# Altium schematic sheet Sht4-Interfaces.SchDoc
size D; SheetNumber: 4; SheetTotal: 4
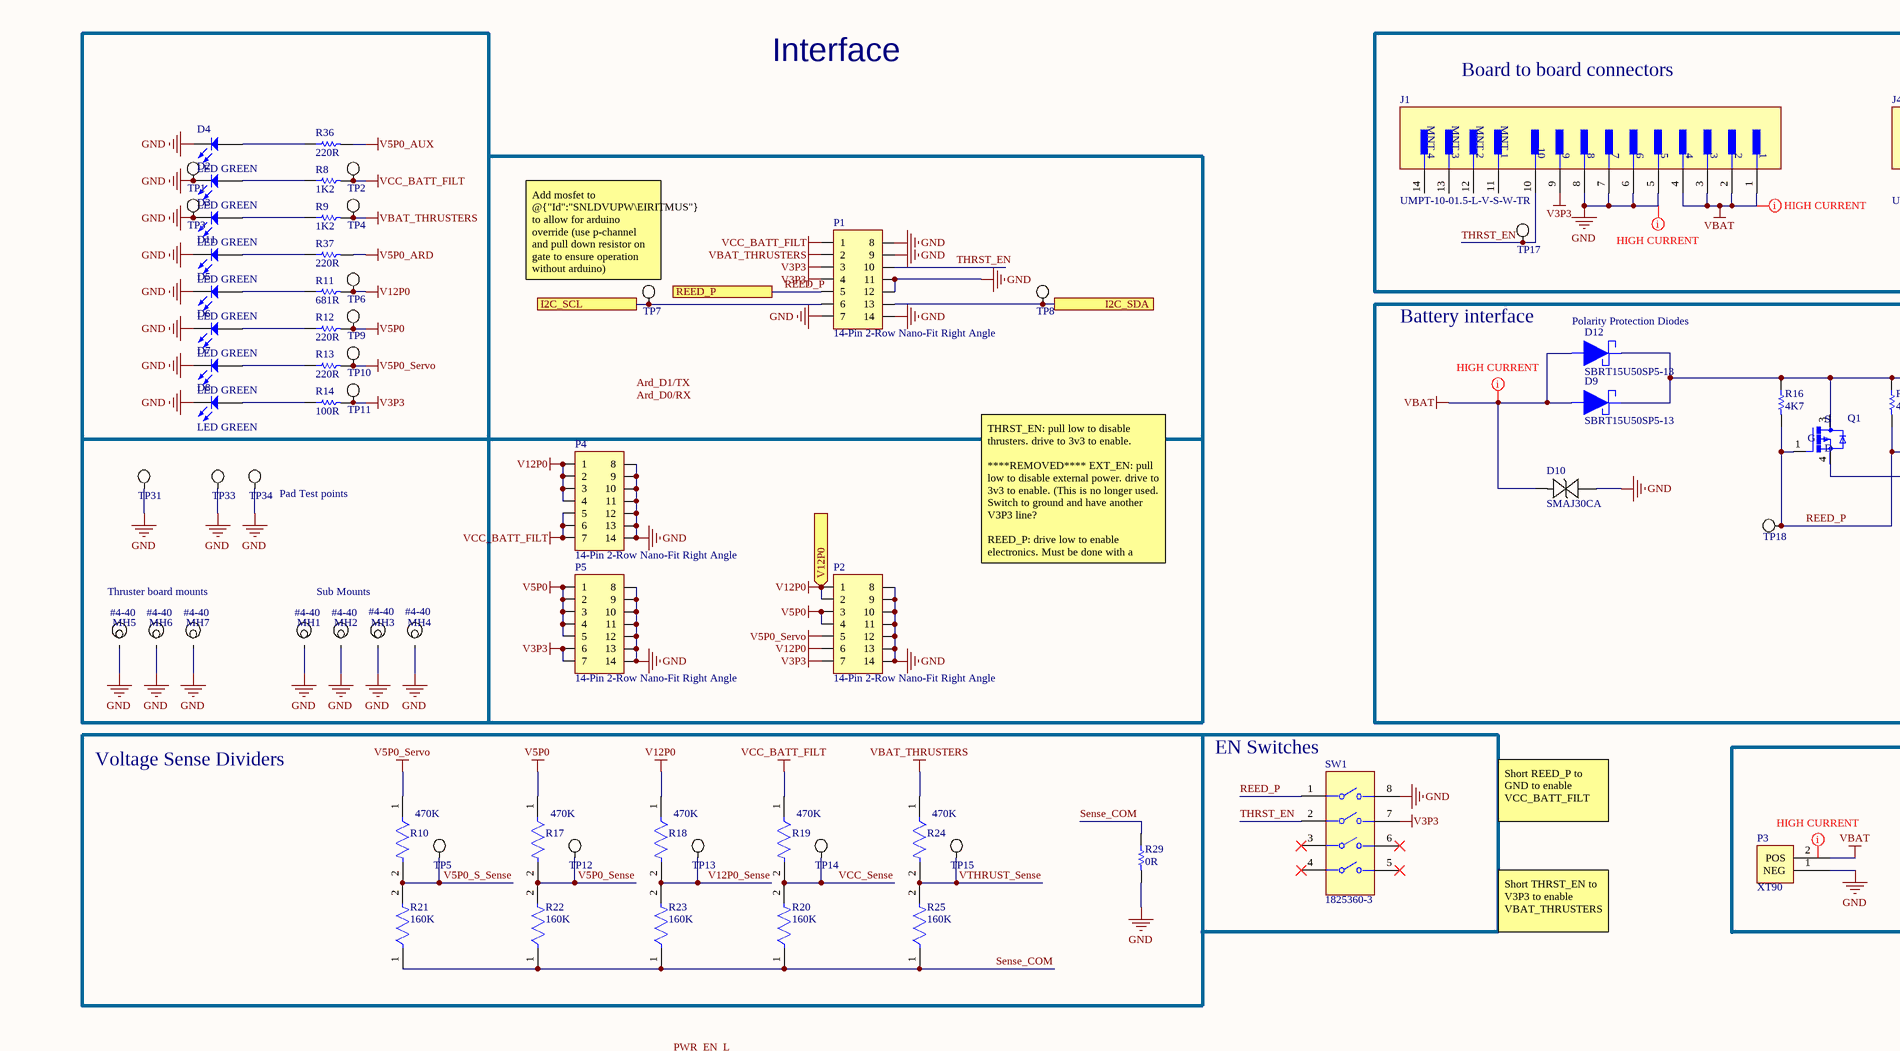
[diagram p0: Sht4-Interfaces.SchDoc, top left]
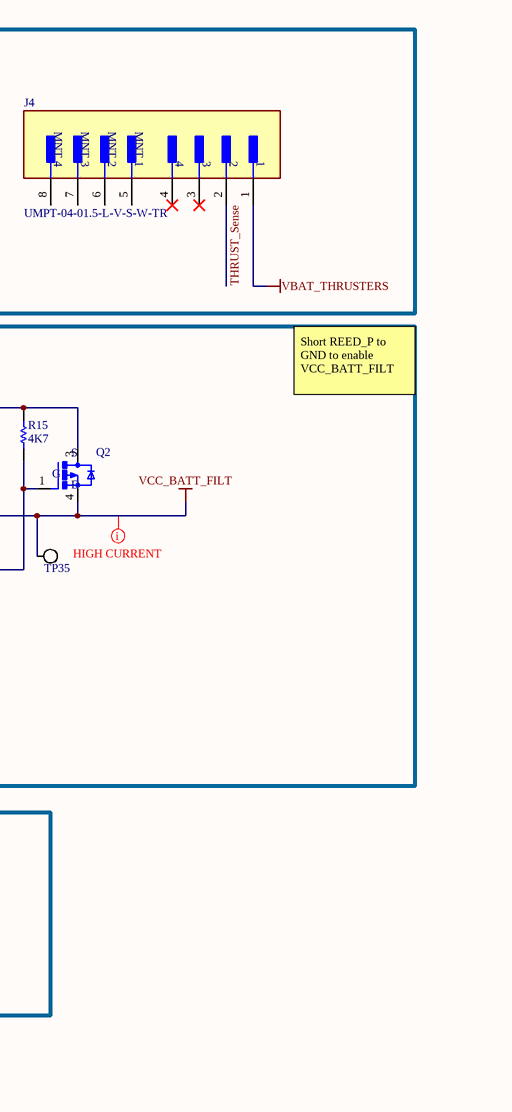
[diagram p1: Sht4-Interfaces.SchDoc, top right]
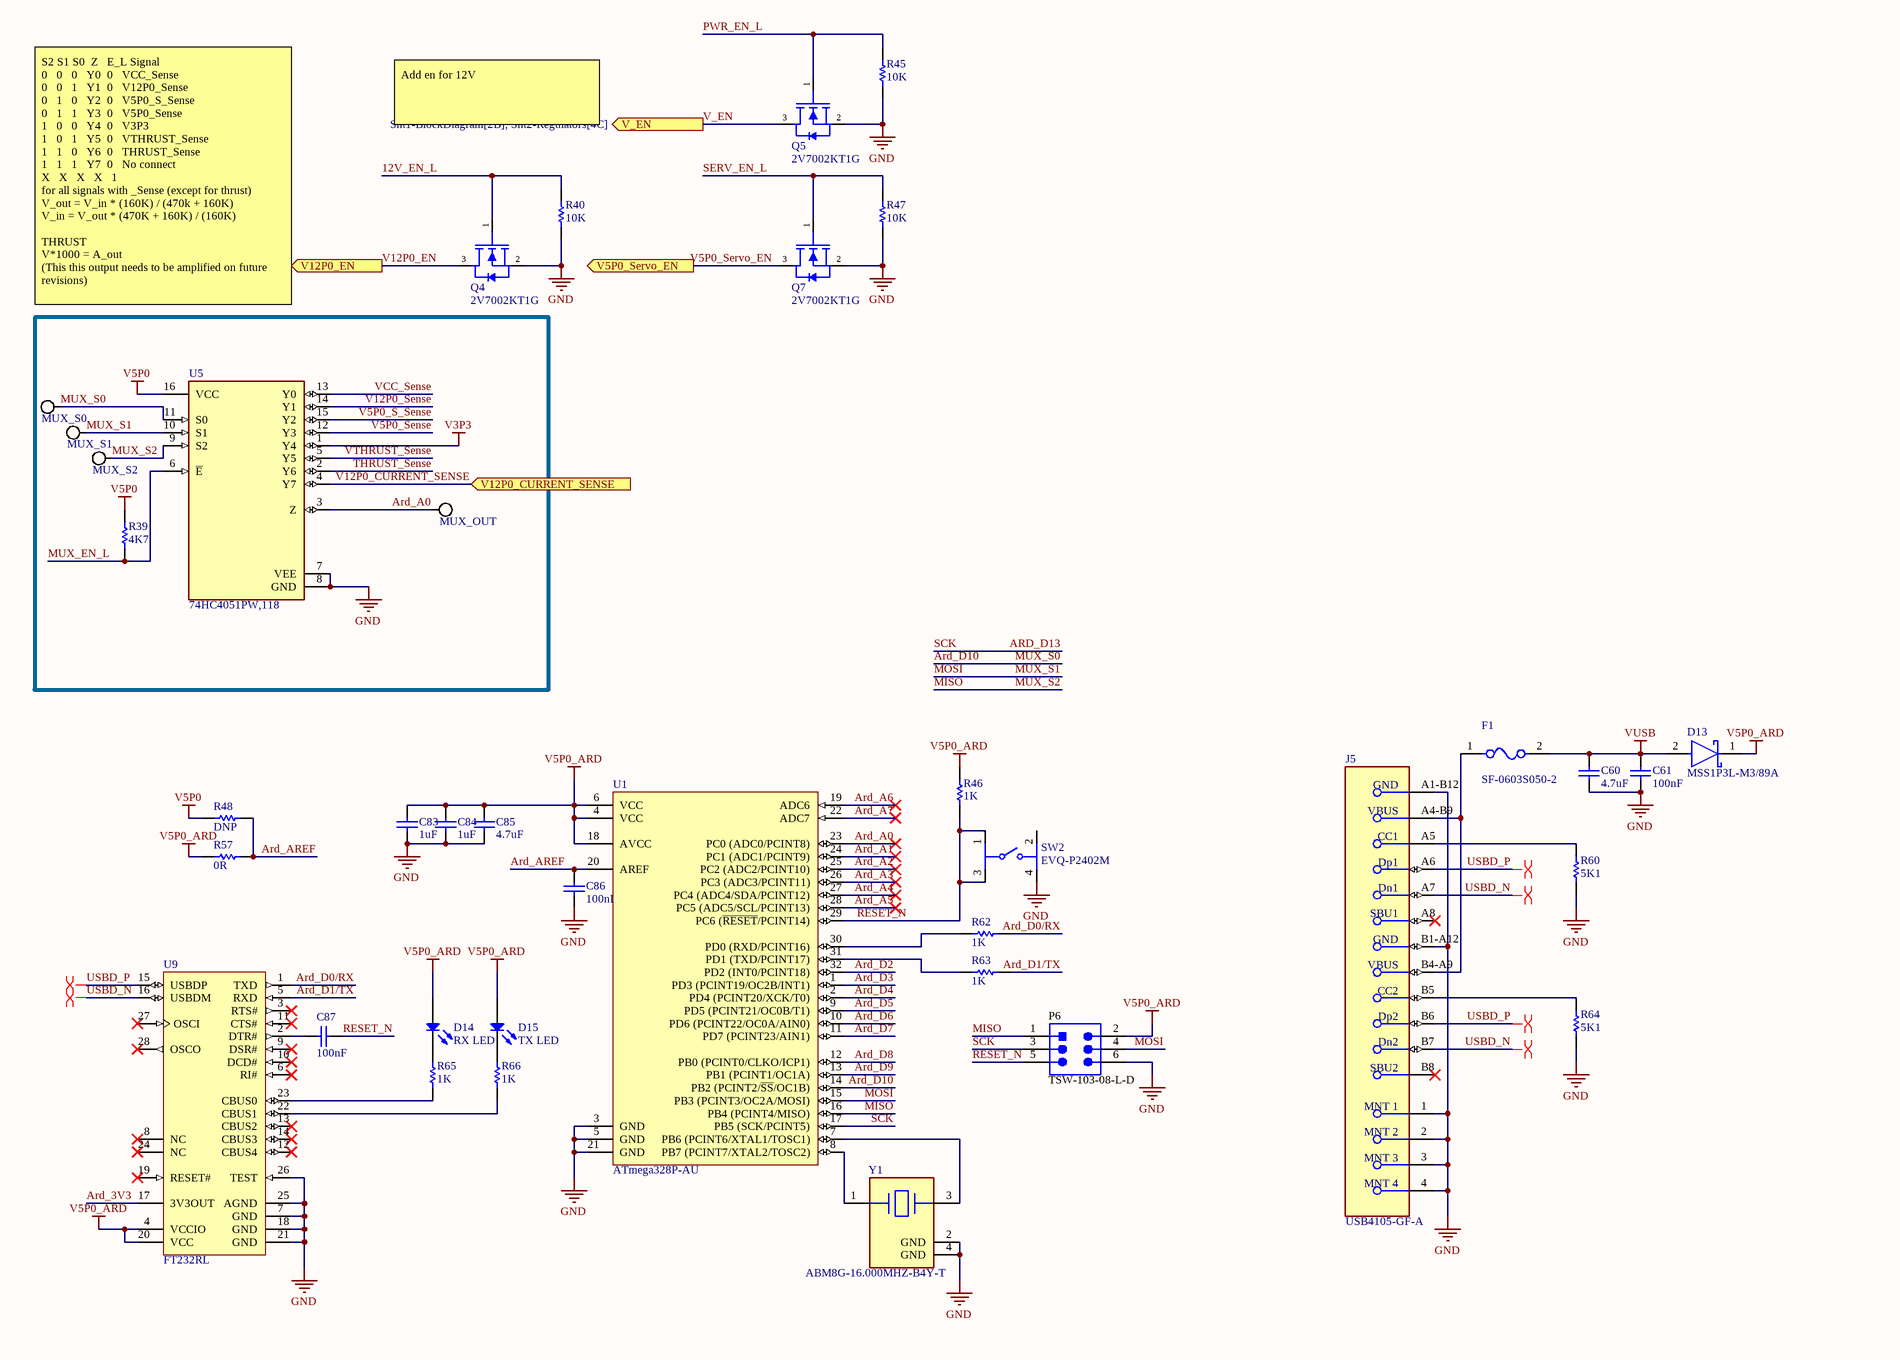
[diagram p2: Sht4-Interfaces.SchDoc, bottom left]
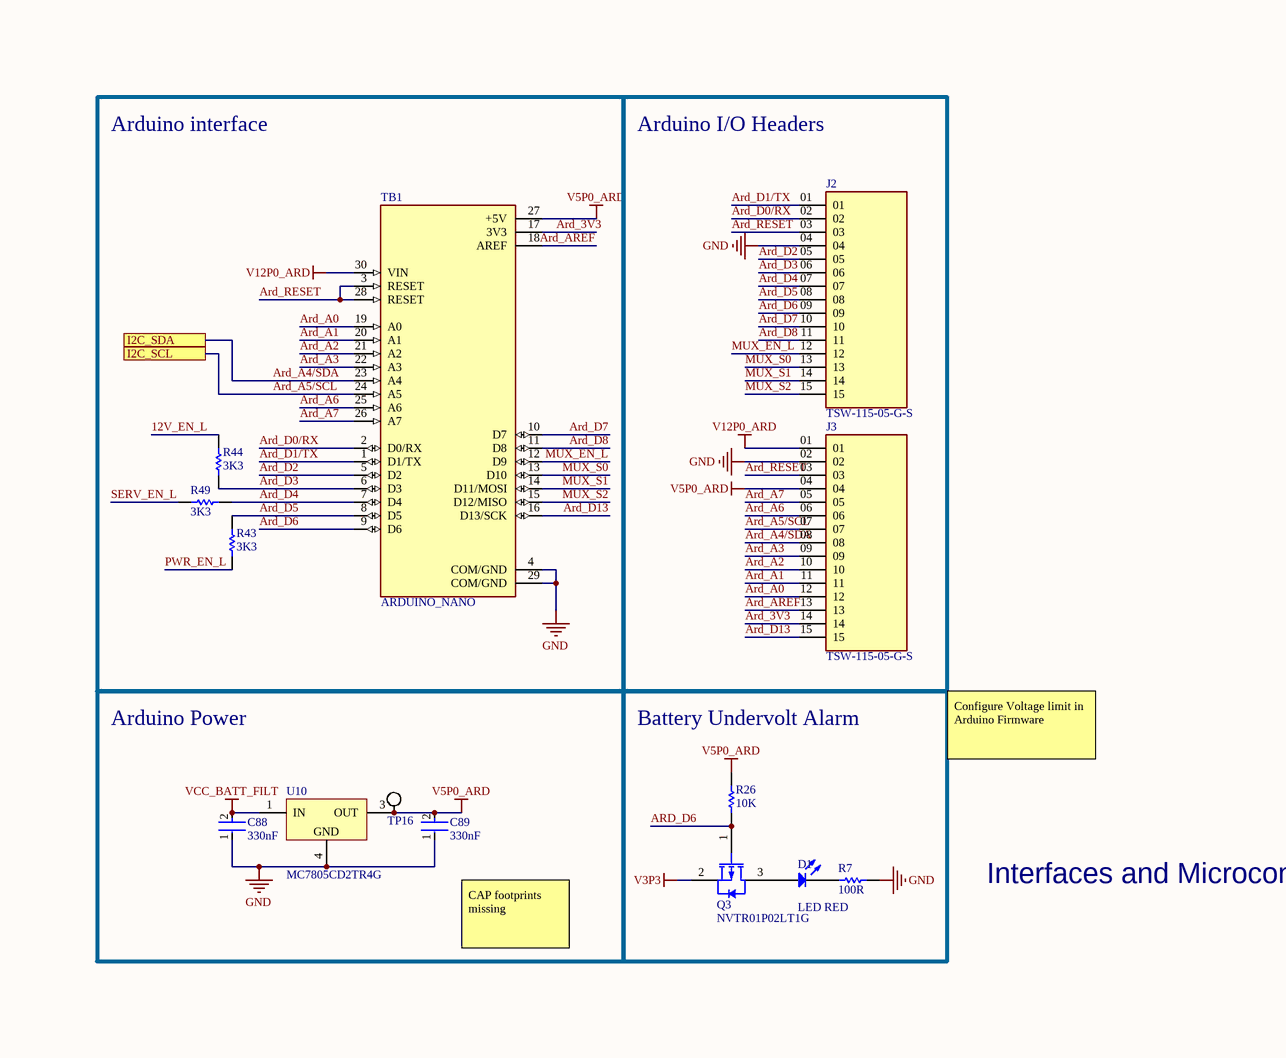
[diagram p3: Sht4-Interfaces.SchDoc, bottom right]

## Parts
C60  4.7uF  [CAPC2013X145X50LL20T25]
C61  100nF  [0603]
C83  1uF  [0603]
C84  1uF  [0603]
C85  4.7uF  [CAPC2013X145X50LL20T25]
C86  100nF  [0603]
C87  100nF  [0603]
C88  330nF  [FP-C1608-080-0_1-IPC_B]
C89  330nF  [FP-C1608-080-0_1-IPC_B]
D1  LED RED  [C0805]
D2  LED GREEN  [LED_0805]
D3  LED GREEN  [LED_0805]
D4  LED GREEN  [LED_0805]
D5  LED GREEN  [LED_0805]
D6  LED GREEN  [LED_0805]
D7  LED GREEN  [LED_0805]
D8  LED GREEN  [LED_0805]
D9  SBRT15U50SP5-13  [SBRT15U50SP5-13]
D10  SMAJ30CA  [SMASeries_LTF]
D11  LED GREEN  [LED_0805]
D12  SBRT15U50SP5-13  [SBRT15U50SP5-13]
D13  MSS1P3L-M3/89A  [FP-96591-MFG]
D14  RX LED  [LED_0805]
D15  TX LED  [LED_0805]
F1  SF-0603S050-2  [FP-SF-0603S-MFG]
J1  UMPT-10-01.5-L-V-S-W-TR  [FP-UMPT-10-01_5-L-V-S-W-T-MFG]
J2  TSW-115-05-G-S  [SAMTEC_TSW-115-05-G-S]
J3  TSW-115-05-G-S  [SAMTEC_TSW-115-05-G-S]
J4  UMPT-04-01.5-L-V-S-W-TR  [FP-UMPT-04-01_5-L-V-S-W-T-MFG]
J5  USB4105-GF-A  [FP-USB4105-GF-A-MFG]
MH1  #4-40  [Mounting Hole #4-40]
MH2  #4-40  [Mounting Hole #4-40]
MH3  #4-40  [Mounting Hole #4-40]
MH4  #4-40  [Mounting Hole #4-40]
MH5  #4-40  [Mounting Hole #4-40]
MH6  #4-40  [Mounting Hole #4-40]
MH7  #4-40  [Mounting Hole #4-40]
MUX_OUT  (no value)  [Test Point Pad]
MUX_S0  (no value)  [Test Point Pad]
MUX_S1  (no value)  [Test Point Pad]
MUX_S2  (no value)  [Test Point Pad]
P1  14-Pin 2-Row Nano-Fit Right Angle  [MOLEX NANO-FIT 2X7 - Right Angle]
P2  14-Pin 2-Row Nano-Fit Right Angle  [MOLEX NANO-FIT 2X7 - Right Angle]
P3  XT90  [XT90]
P4  14-Pin 2-Row Nano-Fit Right Angle  [MOLEX NANO-FIT 2X7 - Right Angle]
P5  14-Pin 2-Row Nano-Fit Right Angle  [MOLEX NANO-FIT 2X7 - Right Angle]
P6  TSW-103-08-L-D  [SMTC-TSW-103-08-L-D_V]
Q1  IRF9Z34STRLPBF  [TO254P1521X483-4N]  (value not drawn)
Q2  IRF9Z34STRLPBF  [TO254P1521X483-4N]  (value not drawn)
Q3  NVTR01P02LT1G  [ONSC-SOT-23-3-318-08_V]
Q4  2V7002KT1G  [2V7002KT1G]
Q5  2V7002KT1G  [2V7002KT1G]
Q7  2V7002KT1G  [2V7002KT1G]
R7  100R  [RESC1609X50X30NL10T20]
R8  1K2  [RESC0603(1608)_L]
R9  1K2  [RESC0603(1608)_L]
R10  470K  [FP-CRCW0805-e3-IPC_C]
R11  681R  [RESC0603(1608)_L]
R12  220R  [RESC0603(1608)_L]
R13  220R  [RESC0603(1608)_L]
R14  100R  [RESC0603(1608)_L]
R15  4K7  [0603]
R16  4K7  [0603]
R17  470K  [FP-CRCW0805-e3-IPC_C]
R18  470K  [FP-CRCW0805-e3-IPC_C]
R19  470K  [FP-CRCW0805-e3-IPC_C]
R20  160K  [FP-CRCW0805-e3-IPC_C]
R21  160K  [FP-CRCW0805-e3-IPC_C]
R22  160K  [FP-CRCW0805-e3-IPC_C]
R23  160K  [FP-CRCW0805-e3-IPC_C]
R24  470K  [FP-CRCW0805-e3-IPC_C]
R25  160K  [FP-CRCW0805-e3-IPC_C]
R26  10K  [RESC1609X50X30NL8T20]
R29  0R  [RESC2013X50X30LL20T20]
R36  220R  [RESC0603(1608)_L]
R37  220R  [RESC0603(1608)_L]
R39  4K7  [0603]
R40  10K  [0603]
R43  3K3  [RESC1609X55X30ML15T15]
R44  3K3  [RESC1609X55X30ML15T15]
R45  10K  [0603]
R46  1K  [RESC1608X55X30LL15T15]
R47  10K  [0603]
R48  DNP  [0805]  (no BOM)
R49  3K3  [RESC1609X55X30ML15T15]
R57  0R  [0805]
R60  5K1  [RESC1608X55X25LL10T15]
R62  1K  [RESC1608X55X30LL15T15]
R63  1K  [RESC1608X55X30LL15T15]
R64  5K1  [RESC1608X55X25LL10T15]
R65  1K  [RESC1608X55X30LL15T15]
R66  1K  [RESC1608X55X30LL15T15]
SW1  1825360-3  [FP-1825360-3-MFG]
SW2  EVQ-P2402M  [FP-EVQ-P2402M-MFG]
TB1  ARDUINO_NANO  [SHIELD_ARDUINO_NANO]  (no BOM)
TP1  Test Point Loop  [Test Point Loop - Black]  (value not drawn)
TP2  Test Point Loop  [Test Point Loop - Black]  (value not drawn)
TP3  Test Point Loop  [Test Point Loop - Black]  (value not drawn)
TP4  Test Point Loop  [Test Point Loop - Black]  (value not drawn)
TP5  (no value)  [Test Point Pad]
TP6  Test Point Loop  [Test Point Loop - Black]  (value not drawn)
TP7  Test Point Loop  [Test Point Loop - Black]  (value not drawn)
TP8  Test Point Loop  [Test Point Loop - Black]  (value not drawn)
TP9  Test Point Loop  [Test Point Loop - Black]  (value not drawn)
TP10  Test Point Loop  [Test Point Loop - Black]  (value not drawn)
TP11  Test Point Loop  [Test Point Loop - Black]  (value not drawn)
TP12  (no value)  [Test Point Pad]
TP13  (no value)  [Test Point Pad]
TP14  (no value)  [Test Point Pad]
TP15  (no value)  [Test Point Pad]
TP16  Test Point Pad  [Test Point Pad]  (value not drawn)
TP17  (no value)  [Test Point Pad]
TP18  (no value)  [Test Point Pad]
TP31  (no value)  [Test Point Pad]
TP33  (no value)  [Test Point Pad]
TP34  (no value)  [Test Point Pad]
TP35  (no value)  [Test Point Pad]
U1  ATmega328P-AU  [32A_M]
U5  74HC4051PW,118  [FP-SOT403-1-IPC_A]
U9  FT232RL  [FTDI-SSOP-28_M]
U10  MC7805CD2TR4G  [ONSC-D2PAK-3-936-03_V]
Y1  ABM8G-16.000MHZ-B4Y-T  [FP-ABM8G-MFG]

## Blocks framed on the sheet
Board to board connectors: J1 J4 TP17
Battery interface: D9 D10 D12 Q1 Q2 R15 R16 TP18 TP35
Voltage Sense Dividers: R10 R17-R25 R29 TP5 TP12-TP15
EN Switches: SW1
Arduino interface: R43 R44 R49 TB1
Arduino I/O Headers: J2 J3
Arduino Power: C88 C89 TP16 U10
Battery Undervolt Alarm: D1 Q3 R7 R26

## Ports
I2C_SCL, I2C_SDA, REED_P, V5P0_Servo_EN (out, see Sht1-BlockDiagram[2B], Sht2-Regulators[1C]), V12P0 (in, see Sht1-BlockDiagram[2B], Sht3-V12P0_reg[5B]), V12P0_CURRENT_SENSE (in, see Sht1-BlockDiagram[2B], Sht3-V12P0_reg[6B]), V12P0_EN (out, see Sht1-BlockDiagram[2B], Sht3-V12P0_reg[2B]), V_EN (out, see Sht1-BlockDiagram[2B], Sht2-Regulators[4C])

## Nets
GND: C60.1 C61.2 C83.1 C84.1 C85.1 C86.1 C88.1 C89.1 D2.1(K) D3.1(K) D4.1(K) D5.1(K) D6.1(K) D7.1(K) D8.1(K) D10.1 D11.1(K) J1.5 J1.6 J1.7 J1.8 J2.04 J3.02 J5.1(MNT_1) J5.2(MNT_2) J5.3(MNT_3) J5.4(MNT_4) J5.A1-B12(GND) J5.B1-A12(GND) MH1.0 MH2.0 MH3.0 MH4.0 MH5.0 MH6.0 MH7.0 P1.7 P1.8 P1.9 P1.11 P1.12 P1.14 P2.8 P2.9 P2.10 P2.11 P2.12 P2.13 P2.14 P3.1(NEG) P4.8 P4.9 P4.10 P4.11 P4.12 P4.13 P4.14 P5.8 P5.9 P5.10 P5.11 P5.12 P5.13 P5.14 P6.6 Q4.2 Q5.2 Q7.2 R7.2 R29.2 R40.1 R45.1 R47.1 R60.2 R64.2 SW1.8 SW2.4 TB1.4(COM/GND) TB1.29(COM/GND) TP1.1 TP3.1 TP31.1 TP33.1 TP34.1 U1.3(GND) U1.5(GND) U1.21(GND) U5.7(VEE) U5.8(GND) U9.7(GND) U9.18(GND) U9.21(GND) U9.25(AGND) U9.26(TEST) U10.4(GND) Y1.2(GND) Y1.4(GND)
V3P3: J1.9 P1.3 P1.4 P2.7 P5.6 P5.7 Q3.2(S) R14.2 SW1.7 TP11.1 U5.1(Y4)
V5P0: P2.3 P2.4 P5.1 P5.2 P5.3 P5.4 P5.5 R12.2 R17.1 R39.2 R48.1 TP9.1 U5.16(VCC)
V5P0_ARD: C83.2 C84.2 C85.2 C89.2 D13.1(C) D14.2(A) D15.2(A) J3.04 P6.2 R26.2 R37.2 R46.2 R57.1 TB1.27(+5V) TP16.1 U1.4(VCC) U1.6(VCC) U1.18(AVCC) U9.4(VCCIO) U9.20(VCC) U10.3(OUT)
V5P0_AUX: R36.2
V5P0_Servo: P2.5 R10.1 R13.2 TP10.1
V12P0: P2.1 P2.2 P2.6 P4.1 P4.2 P4.3 P4.4 R11.2 R18.1 TP6.1 ; port V12P0
V12P0_ARD: J3.01 TB1.30(VIN)
VBAT: D9.1 D10.2 D12.1 J1.1 J1.2 J1.3 J1.4 P3.2(POS)
VBAT_THRUSTERS: J4.1 P1.2 R9.2 R24.1 TP4.1
VCC_BATT_FILT: C88.2 P1.1 P4.5 P4.6 P4.7 Q1.4(D) Q2.4(D) R8.2 R19.1 TP2.1 TP35.1 U10.1(IN)
VUSB: C60.2 C61.1 D13.2(A) F1.2
12V_EN_L: Q4.1 R40.2 R44.1
Ard_3V3: J3.14 TB1.17(3V3) U9.17(3V3OUT)
Ard_A0: J3.12 MUX_OUT.1 TB1.19(A0) U1.23(PC0_(ADC0/PCINT8)) U5.3(Z)
Ard_A1: J3.11 TB1.20(A1) U1.24(PC1_(ADC1/PCINT9))
Ard_A2: J3.10 TB1.21(A2) U1.25(PC2_(ADC2/PCINT10))
Ard_A3: J3.09 TB1.22(A3) U1.26(PC3_(ADC3/PCINT11))
Ard_A4: U1.27(PC4_(ADC4/SDA/PCINT12))
Ard_A4/SDA: J3.08 P1.13 TB1.23(A4) TP8.1 ; port I2C_SDA
Ard_A5: U1.28(PC5_(ADC5/SCL/PCINT13))
Ard_A5/SCL: J3.07 P1.6 TB1.24(A5) TP7.1 ; port I2C_SCL
Ard_A6: J3.06 TB1.25(A6) U1.19(ADC6)
Ard_A7: J3.05 TB1.26(A7) U1.22(ADC7)
Ard_AREF: C86.2 J3.13 R48.2 R57.2 TB1.18(AREF) U1.20(AREF)
Ard_D0/RX: J2.02 R62.2 TB1.2(D0/RX) U9.1(TXD)
Ard_D1/TX: J2.01 R63.2 TB1.1(D1/TX) U9.5(RXD)
Ard_D2: J2.05 TB1.5(D2) U1.32(PD2_(INT0/PCINT18))
Ard_D3: J2.06 R44.2 TB1.6(D3) U1.1(PD3_(PCINT19/OC2B/INT1))
Ard_D4: J2.07 R49.2 TB1.7(D4) U1.2(PD4_(PCINT20/XCK/T0))
Ard_D5: J2.08 R43.2 TB1.8(D5) U1.9(PD5_(PCINT21/OC0B/T1))
Ard_D6: J2.09 Q3.1(G) R26.1 TB1.9(D6) U1.10(PD6_(PCINT22/OC0A/AIN0))
Ard_D7: J2.10 TB1.10(D7) U1.11(PD7_(PCINT23/AIN1))
Ard_D8: J2.11 TB1.11(D8) U1.12(PB0_(PCINT0/CLKO/ICP1))
Ard_D9: U1.13(PB1_(PCINT1/OC1A))
Ard_D10: J2.13 MUX_S0.1 TB1.13(D10) U1.14(PB2_(PCINT2/~{SS}/OC1B)) U5.11(S0)  [also labelled MUX_S0]
Ard_D13: J3.15 P6.3 TB1.16(D13/SCK) U1.17(PB5_(SCK/PCINT5))  [also labelled SCK]
Ard_RESET: J2.03 J3.03 TB1.3(RESET) TB1.28(RESET)
MISO: J2.15 MUX_S2.1 P6.1 TB1.15(D12/MISO) U1.16(PB4_(PCINT4/MISO)) U5.9(S2)  [also labelled MUX_S2]
MOSI: J2.14 MUX_S1.1 P6.4 TB1.14(D11/MOSI) U1.15(PB3_(PCINT3/OC2A/MOSI)) U5.10(S1)  [also labelled MUX_S1]
MUX_EN_L: J2.12 R39.1 TB1.12(D9) U5.6(~{E})
PWR_EN_L: Q5.1 R43.1 R45.2
REED_P: P1.5 Q1.1(G) Q2.1(G) R15.2 R16.2 SW1.1 TP18.1 ; port REED_P
RESET_N: C87.1 P6.5 R46.1 SW2.1 SW2.3 U1.29(PC6_(~{RESET}/PCINT14))
Sense_COM: R20.1 R21.1 R22.1 R23.1 R25.1 R29.1
SERV_EN_L: Q7.1 R47.2 R49.1
THRST_EN: J1.10 P1.10 SW1.2 TP17.1
THRUST_Sense: J4.2 U5.2(Y6)
USBD_N: J5.A7(Dn1) J5.B7(Dn2) U9.16(USBDM)
USBD_P: J5.A6(Dp1) J5.B6(Dp2) U9.15(USBDP)
V5P0_S_Sense: R10.2 R21.2 TP5.1 U5.15(Y2)
V5P0_Sense: R17.2 R22.2 TP12.1 U5.12(Y3)
V5P0_Servo_EN: Q7.3 ; port V5P0_Servo_EN
V12P0_CURRENT_SENSE: U5.4(Y7) ; port V12P0_CURRENT_SENSE
V12P0_EN: Q4.3 ; port V12P0_EN
V12P0_Sense: R18.2 R23.2 TP13.1 U5.14(Y1)
V_EN: Q5.3 ; port V_EN
VCC_Sense: R19.2 R20.2 TP14.1 U5.13(Y0)
VTHRUST_Sense: R24.2 R25.2 TP15.1 U5.5(Y5)
NetC87_2: C87.2 U9.2(DTR#)
NetD1_1: D1.1(K) R7.1
NetD1_2: D1.2(A) Q3.3(D)
NetD2_2: D2.2(A) R8.1
NetD3_2: D3.2(A) R9.1
NetD4_2: D4.2(A) R36.1
NetD5_2: D5.2(A) R11.1
NetD6_2: D6.2(A) R12.1
NetD7_2: D7.2(A) R13.1
NetD8_2: D8.2(A) R14.1
NetD9_2: D9.2 D12.2 Q1.3(S) Q2.3(S) R15.1 R16.1
NetD11_2: D11.2(A) R37.1
NetD14_1: D14.1(K) R65.2
NetD15_1: D15.1(K) R66.2
NetF1_1: F1.1 J5.A4-B9(VBUS) J5.B4-A9(VBUS)
NetJ5_A5: J5.A5(CC1) R60.1
NetJ5_B5: J5.B5(CC2) R64.1
NetR62_1: R62.1 U1.30(PD0_(RXD/PCINT16))
NetR63_1: R63.1 U1.31(PD1_(TXD/PCINT17))
NetR65_1: R65.1 U9.23(CBUS0)
NetR66_1: R66.1 U9.22(CBUS1)
NetU1_7: U1.7(PB6_(PCINT6/XTAL1/TOSC1)) Y1.3
NetU1_8: U1.8(PB7_(PCINT7/XTAL2/TOSC2)) Y1.1

Not connected (* = marked no-connect by the designer): J1 11(MNT_1) 12(MNT_2) 13(MNT_3) 14(MNT_4); J4 3* 4* 5(MNT_1) 6(MNT_2) 7(MNT_3) 8(MNT_4); J5 A8(SBU1)* B8(SBU2)*; SW1 3* 4* 5* 6*; SW2 2; U9 3(RTS#)* 6(RI#)* 8(NC)* 9(DSR#)* 10(DCD#)* 11(CTS#)* 12(CBUS4)* 13(CBUS2)* 14(CBUS3)* 19(RESET#)* 24(NC)* 27(OSCI)* 28(OSCO)*

## Layout directives
mark named HIGH CURRENT: (no net found under the mark), GND, VBAT, VCC_BATT_FILT
differential pair: USBD_N, USBD_P

## Notes on the sheet
- Interface
- (near TP7) Add mosfet to @{"Id":"SNLDVUPW\EIRITMUS"} to allow for arduino override (use p-channel and pull down resistor on gate to ensure operation without arduino)
- (near D12) Polarity Protection Diodes
- Short REED_P to GND to enable VCC_BATT_FILT
- (near TP34) Pad Test points
- THRST_EN: pull low to disable thrusters. drive to 3v3 to enable.
  ****REMOVED**** EXT_EN: pull low to disable external power. drive to 3v3 to enable. (This is no longer used. Switch to ground and have another V3P3 line?
  REED_P: drive low to enable electronics. Must be done with a hardware switch.
- Thruster board mounts
- Sub Mounts
- Short THRST_EN to V3P3 to enable VBAT_THRUSTERS
- Add en for 12V
- S2 S1 S0  Z   E_L Signal
  0   0   0   Y0  0   VCC_Sense
  0   0   1   Y1  0   V12P0_Sense
  0   1   0   Y2  0   V5P0_S_Sense
  0   1   1   Y3  0   V5P0_Sense
  1   0   0   Y4  0   V3P3
  1   0   1   Y5  0   VTHRUST_Sense
  1   1   0   Y6  0   THRUST_Sense
  1   1   1   Y7  0   No connect
  X   X   X   X   1
  for all signals with _Sense (except for thrust)
  V_out = V_in * (160K) / (470k + 160K)
  V_in = V_out * (470K + 160K) / (160K)
  THRUST
  V*1000 = A_out
  (This this output needs to be amplified on future revisions)
  V12P0_CURRENT_SENSE:
  I_out = 15.5A/(2.5V - V12P0_CURRENT_SENSE)
- Configure Voltage limit in Arduino Firmware
- CAP footprints missing
- Interfaces and Microcontroller
- Labels drawn without touching a wire or pin: Ard_D0/RX, Ard_D1/TX, V5P0_Servo_EN

## Library data of the parts
C60 C85 = CMP-2007-01014-1: C0805C475M3PACTU; Manufacturer: Kemet; Part Number: C0805C475M3PACTU
C61 C86 C87 = 100nF 0603: CAP 100nF 100V ±10% 0603 (1608 Metric) Thickness 1mm SMD; Tolerance: Â±10%; Case-Metric: 1608; Rated Voltage: 100 V; Case-EIA: 0603; Value: 100nF; Technology: SMT; Max Thickness: 1 mm; ComponentLink1Description: Link; ComponentLink1URL: https://www.digikey.com/en/products/detail/samsung-electro-mechanics/CL10B104KC8NNNC/5961291
C83 C84 = 1uF 0603: CAP 1uF 25V ±10% 0603 (1608 Metric) Thickness 1mm SMD; Tolerance: Â±10%; Case-Metric: 1608; Technology: SMT; Rated Voltage: 25 V; Case-EIA: 0603; Max Thickness: 1 mm; Value: 1uF; ComponentLink1Description: Link; ComponentLink1URL: https://www.digikey.com/en/products/detail/samsung-electro-mechanics/CL10B105KA8NNNC/3886842
C88 C89 = CMP-2000-07551-2: Multilayer Ceramic Capacitors 330nF ±10% 50V X7R SMD 0603; Capacitance: 330nF; Case Code (Imperial): 0603; Case Code (Metric): 1608; Dielectric: X7R; Length: 1.6mm; Construction: Flat; Resistor Type: Ceramic; Mount: Surface Mount; Voltage Rating: 50V; Packaging: Tape and Reel; Series: C; Case/Package: 0603; Lead Free: Lead Free; Tolerance: 10%; Voltage: 50V; REACH SVHC: No SVHC; Height: 0.8mm; Weight: 7.1E-05oz; Termination: SMD/SMT; Max Operating Temperature: 125°C; RoHS Compliant: Yes; Min Operating Temperature: -55°C; Depth: 0.8mm; Package Quantity: 1; Thickness: 0.037inch; Voltage Rating (DC): 50V; Dielectric Material: Ceramic; Width: 0.031inch
D1 = Red LED 0805: led / LTST-C171KRKT; Manufacturer: Lite-On Inc.; Lens Color: Colorless; Lens Transparency: Clear; Millicandela Rating: 54mcd; Lens Style/Size: Rectangle with Flat Top, 1.40mm x 1.25mm; Voltage - Forward (Vf) (Typ): 2V; Current - Test: 20mA; Viewing Angle: 130°; Wavelength - Dominant: 631nm; Wavelength - Peak: 639nm; Supplier 1: Digi-Key; Supplier Part Number 1: 160-1427-1-ND; Manufacturer Part Number: LTST-C171KRKT; RoHS: RoHS Compliant; Category: Optoelectronics; Stock 1: 260544; Pricing 1: 1=0.31, 10=0.225, 25=0.1656, 100=0.1183, 250=0.0804, 500=0.07096, 1000=0.05558 (USD); Packaging: Cut Tape (CT); Part Status: Active; Color: Red; Mounting Type: Surface Mount; Features: -; Package / Case: 0805 (2012 Metric); Size / Dimension: 2.00mm L x 1.25mm W; Height (Max): 0.80mm; ComponentLink1URL: http://optoelectronics.liteon.com/upload/download/DS22-2000-109/LTST-C171KRKT.pdf; ComponentLink1Description: http://optoelectronics.liteon.com/upload/download/DS22-2000-109/LTST-C171KRKT.pdf; ComponentLink2Description: Link; ComponentLink2URL: https://www.digikey.com/en/products/detail/liteon/LTST-C171KRKT/386801
D2-D8 D11 = Green LED 0805: led; Manufacturer: Lite-On Inc.; Manufacturer Part Number: LTST-C171KGKT; Lens Color: Colorless; Lens Transparency: Clear; Millicandela Rating: 35mcd; Lens Style/Size: Rectangle with Flat Top, 1.40mm x 1.25mm; Voltage - Forward (Vf) (Typ): 2V; Current - Test: 20mA; Viewing Angle: 130°; Wavelength - Dominant: 571nm; Wavelength - Peak: 574nm; Supplier 1: Digi-Key; Supplier Part Number 1: 160-1426-1-ND; RoHS: RoHS Compliant; Category: Optoelectronics; Stock 1: 350441; Pricing 1: 1=0.31, 10=0.225, 25=0.1656, 100=0.1183, 250=0.0804, 500=0.07096, 1000=0.05558 (USD); Packaging: Cut Tape (CT); Part Status: Active; Color: Green; Mounting Type: Surface Mount; Features: -; Package / Case: 0805 (2012 Metric); Size / Dimension: 2.00mm L x 1.25mm W; Height (Max): 0.90mm; ComponentLink1URL: http://optoelectronics.liteon.com/upload/download/DS22-2000-118/LTST-C171KGKT.pdf; ComponentLink1Description: http://optoelectronics.liteon.com/upload/download/DS22-2000-118/LTST-C171KGKT.pdf; ComponentLink2Description: Link; ComponentLink2URL: https://www.digikey.com/en/products/detail/LTST-C171KGKT/160-1426-1-ND/386798?curr=usd&utm_campaign=buynow&utm_medium=aggregator&utm_source=octopart
D10 = SMAJ30CA: No Description Available; Mfr_Name: Littelfuse Inc; Digi-Key_Part_Number_8: SMAJ30CALFTR-ND; Digi-Key_Part_Number_7: SMAJ30CALFDKR-ND; Digi-Key_Part_Number_1: 2516-SMAJ30CATR-ND; Digi-Key_Part_Number_2: 2997-SMAJ30CATR-ND; Digi-Key_Part_Number_3: SMAJ30CABCT-ND; Digi-Key_Part_Number_4: SMAJ30CABDKR-ND; Digi-Key_Part_Number_5: SMAJ30CABTR-ND; Digi-Key_Part_Number_6: SMAJ30CALFCT-ND
D13 = CMP-02539-000006-1: DIODE SCHOTTKY 30V 1A MICROSMP; Manufacturer: Vishay; Max Junction Temp: +150°C; Max Surge Forward Current: 25A; Value: 65pF; Peak Reverse Current: 15uA; Max Repetitive Reverse Voltage: 30V; Mouser Description: Schottky Diodes & Rectifiers 1.0 Amp 30 Volt; Device Class L2: Diodes; RoHS: TRUE; Temperature Range Low: -55°C; ComponentLink2URL: http://www.vishay.com/docs/89020/mss1p3l.pdf; Octopart: https://octopart.com/mss1p3l-m3%2F89a-vishay-42670898; Automotive: No; Height: 0.73mm; Temperature: -55°C to +150°C; Temperature Range High: +150°C; ComponentLink2Description: Datasheet; Lead Free: Yes; Digikey Description: DIODE SCHOTTKY 30V 1A MICROSMP; Forward Current: 1A; Manufacturer Part Number: MSS1P3L-M3/89A; Footprint Url: http://www.vishay.com/docs/96591/microsmp_do-219ad_fredpt.pdf; Device Class L1: Discrete Semiconductors; Capacitance: 65pF; Device Class L3: Schottky Diodes; Package: 96591; Category: Diode
D14 D15 = LED0: led; Manufacturer: Lite-On Inc; Manufacturer Part Number: LTST-C171AKT; Color: Red; Wavelength - Dominant: 631nm; Wavelength - Peak: 639nm; Millicandela Rating: 54mcd; Voltage - Forward (Vf) (Typ): 2V; Current - Test: 20mA; Viewing Angle: 130°; Lens Type: Clear; Lens Style/Size: Rectangle with Flat Top, 1.4mm x 1.25mm; Published: 8-Jun-2000; LatestRevisionDate: 08-Jul-2005; LatestRevisionNote: Mech Layer 1 removed.; PackageReference: LED-0; Publisher: Altium Limited; PackageDescription: LED; 2 Leads; Supplier 1: Digi-Key; Supplier Part Number 1: 160-1419-1-ND; RoHS: RoHS Compliant; Category: Optoelectronics; Stock 1: 72989; Pricing 1: 1=0.32, 10=0.248, 100=0.135, 250=0.09, 500=0.0765, 1000=0.0585 (USD); Packaging: Cut Tape (CT); Package / Case: 0805 (2012 Metric); Size / Dimension: 2.00mm L x 1.25mm W; Height: 0.80mm; Mounting Type: Surface Mount; Luminous Flux @ Current - Test: -; ComponentLink1URL: http://optoelectronics.liteon.com/upload/download/DS22-2000-109/S_110_LTST-C171KRKT.pdf; ComponentLink1Description: http://optoelectronics.liteon.com/upload/download/DS22-2000-109/S_110_LTST-C171KRKT.pdf
F1 = CMP-07399-000004-1: FUSE BOARD MNT 500MA 50VDC 0603; Manufacturer: Bourns Inc.; Fuse I2T: 0.009A2Sec; Fuse Current: 0.5A; Fuse Interrupt Ac Current: 50A; Max Fuse Ac Voltage: 35V; Resistance: 232mΩ; Fuse Blow Speed: Slow; Value: 232mΩ; Max Fuse Dc Voltage: 50V; Automotive: No; Category: Fuse; Temperature Range High: +105°C; Device Class L1: Circuit Protection; Height: 0.55mm; RoHS: TRUE; ComponentLink2URL: https://www.bourns.com/docs/product-datasheets/sf0603s.pdf; Ipc Land Pattern Name: CAPC16080X45; Temperature Range Low: -20°C; Mouser Description: Surface Mount Fuses 0.50A Slow Blow SinglFuse; Manufacturer Part Number: SF-0603S050-2; Package: SF-0603S; Device Class L3: unset; Digikey Description: FUSE BOARD MNT 500MA 50VDC 0603; Device Class L2: Fuses; Lead Free: Yes; Temperature: -20°C to +105°C; ComponentLink2Description: Datasheet; Octopart: https://octopart.com/sf-0603s050-2-bourns-10486821; Fuse Interrupt Dc Current: 50A
J1 = UMPT-10-1.5: CONN MPOWER 2MM MALE 10POS GOLD; System: Connector; ComponentLink1Description: Link; ComponentLink1URL: https://www.digikey.com/en/products/detail/samtec-inc/UMPT-10-01-5-L-V-S-W-TR/14670365?s=N4IgTCBcDaIKoFkAKAVAtARgAxqxgdAKxoAyaAamgMpoDqaKASiALoC%2BQA
J2 J3 = TSW-115-05-G-S: MF: Samtec; Value: *; Availability: Unavailable; Price: None; MP: TSW-115-05-G-S; Package: None
J4 = UMPT-04-1.5: CONN MPOWER 2MM MALE 4POS GOLD; ComponentLink1Description: Link; ComponentLink1URL: https://www.digikey.com/en/products/detail/samtec-inc/UMPT-04-01-5-L-V-S-W-TR/14670336?s=N4IgTCBcDaIKoFkAKAVAtABgCyYIwDoBWNAGTQDU0BlNAdTRQCUQBdAXyA
J5 = CMP-245163-000001-1: CONN RCPT USB2.0 TYPEC 5A; Manufacturer: GCT; Voltage Rating: 20V; Is Female: yes; Current Rating: 5/6.25/1.25/0.25A; Number Of Contacts: 16; Conn Orientation: Right Angle; Device Class L1: Connectors; Category: Conn; Lead Free: Yes; RoHS: TRUE; Temperature Range High: +85°C; Digikey Description: CONN RCPT USB2.0 TYPEC 5A; Device Class L3: unset; ComponentLink2Description: Datasheet; Manufacturer Part Number: USB4105-GF-A; Package: 0; Usb Standard: USB 2.0; Device Class L2: USB Connectors; Automotive: No; Temperature Range Low: -40°C; Height: 3.46mm; Temperature: -40°C to +85°C; Contact Material: Gold,Nickel; ComponentLink2URL: https://gct.co/files/drawings/usb4105.pdf; Octopart: https://octopart.com/usb4105-gf-a-gct-106627878
MH1-MH7 = Mounting Hole #4-40, Loose Fit: Mounting Hole for ANSI #4-40 w/ Flat Washer, Loose Fit; Datasheet: http://blogs.mentor.com/tom-hausherr/blog/tag/pcb-mounting-holes/
MUX_OUT MUX_S0-MUX_S2 TP5 TP12-TP15 TP17 TP18 TP31 TP33-TP35 = Test Point Pad: Test point, Pad, 28 mil
P1 P2 P4 P5 = 14-Pin 2-Row Nano-Fit Right Angle: NanoFit Right Hdr TH DR 14Ckt; Part Number: 105314-1214; Manufacturer: Molex; Supplier: Mouser; Supplier Part Number: 538-105314-1214; Supplier 1: Mouser; Supplier Part Number 1: 538-105314-1214; ComponentLink1Description: Mouser Link; ComponentLink1URL: https://www.mouser.com/ProductDetail/Molex/105314-1214?qs=PqFvFmEiOr6wLIXpvlvqbA%3D%3D; ComponentLink2Description: Link; ComponentLink2URL: https://www.digikey.com/en/products/detail/molex/1053141114/7693193
P6 = CMP-1024-00336-5: Male Header, Pitch 2.54 mm, 2 x 3 Position, Height 8.38 mm, Tail Length 5.08 mm, -55 to 125 degC, RoHS, Bulk; Manufacturer: Samtec; DatasheetVersion: 04/2012; ComponentLink3URL: http://suddendocs.samtec.com/prints/tsw-xxx-xx-x-x-xx-xxx-footprint.pdf; PackageReference: TSW-103-08-L-D; Mounting Technology: Through Hole; Min Operating Temperature: -55 degC; ComponentLink2Description: Datasheet; Lead Pitch: 2.54 mm; ComponentLink1Description: Manufacturer URL; Mount: Through Hole; ComponentLink1URL: http://www.samtec.com/; ComponentLink3Description: Package Specification; Max Operating Temperature: 125 degC; PackageDescription: Male Header, Pitch 2.54 mm, 2 x 3 Position, Height 8.38 mm, Tail Length 5.08 mm; ComponentLink2URL: https://datasheet.ciiva.com/25618/0900766b81154476-25618436.pdf; RoHSCompliant: true
Q1 Q2 = IRF9Z34STRLPBF: P-Channel 60V 18A _Tc_ 3.7W _Ta_, 88W _Tc_ Surface Mount D2PAK; MF: Vishay; Package: D2PAK Vishay; Value: *; Availability: Unavailable; MP: IRF9Z34STRLPBF; Price: None; SnapEDA_Link: https://www.snapeda.com/parts/IRF9Z34STRLPBF/Vishay%20Siliconix/view-part/813693/?ref=snap
Q3 = PMOS SOT-23: Power MOSFET, -20 V, -1.3 A, P-Channel, 3-Pin SOT-23, Pb-Free, Tape and Reel; Manufacturer: On Semiconductor; Ciss Typ (pF): 225; Configuration: Single; Coss Typ (pF): 130; PD Max (W): 0.4; ID Max (A): 1.3; Crss Typ (pF): 55; VGS Max (V): 12; V(BR)DSS Min (V): 20; VGS(th) Max (V): 1.25; Qrr Typ (nC): 8.5; Channel Polarity: P Channel; ComponentLink1URL: http://www.onsemi.com/; PackageReference: SOT-23-3-318-08; RoHS: Pb-Free; ComponentLink1Description: Manufacturer URL; PackageDescription: 3-Pin Small Outline Transistor, Body 2.92 x 1.3 mm, Pitch 0.95 mm; ComponentLink3Description: Package Specification; ComponentLink2Description: Datasheet; Package Type: SOT-23-3; ComponentLink2URL: http://www.onsemi.cn/pub_link/Collateral/NTR1P02LT1-D.PDF; Packing: Tape and Reel; Mounting Technology: Surface Mount; ComponentLink3URL: http://www.onsemi.cn/pub_link/Collateral/318-08.PDF; PartNumber: NVTR01P02LT1G; PackageVersion: Rev. AP, 11/2009; DatasheetVersion: Rev. 13; ComponentLink4Description: Link; ComponentLink4URL: https://www.digikey.com/en/products/detail/vishay-siliconix/IRF9Z34STRLPBF/856689?s=N4IgTCBcDaIJICUBiBOAWgZgCwGUAqCAMgAoBCSIAugL5A
Q4 Q5 Q7 = 2V7002KT1G: MOSFET N-CH 60V 320MA SOT-23-3; Supplier: DigiKey; Supplier Part Number: 2V7002KT1GOSCT-ND; Part Number: 2V7002KT1G; Datasheet URL: www.mouser.com/ds/2/308/2N7002K-D-40616.pdf
R7 = 100R 0603: 100R 0.1W 5%; Part Number: CRCW0603100RJNTA; Manufacturer: Vishay Dale; ComponentLink1Description: Link; ComponentLink1URL: https://www.digikey.com/en/products/detail/yageo/RC0603FR-13100RL/12756392
R8 R9 = CMP-1012-00518-1: 1K2 0.1W 1% 0603 (1608 Metric)  SMD; Case-EIA: 0603; Value: 1200.00 Ohm; Case-Metric: 1608; Power: 0.1 W; Technology: SMT; Tolerance: 1 %
R10 R17-R19 R24 = 470K 0805: RES Thick Film, 470kΩ, 1%, 0.125W, 100ppm/°C, 0805; Power Rating: 125mW; Voltage Rating (DC): 150V; Depth: 1.25mm; Voltage Rating: 150V; Composition: Thick Film; Temperature Coefficient: 100ppm/°C; Max Operating Temperature: 155°C; Min Operating Temperature: -55°C; Package Quantity: 10; Width: 0.049inch; Number of Pins: 2; Length: 2mm; Case Code (Metric): 2012; Weight: 0.000194oz; Features: Automotive AEC-Q200; Number of Terminations: 2; Radiation Hardening: No; Height: 0.45mm; Military Standard: Not; Tolerance: 1%; Lead Free: Lead Free; Termination: SMD/SMT; Case Code (Imperial): 0805; Case/Package: 0805; Contact Plating: Tin; Packaging: Tape and Reel; Max Power Dissipation: 125mW; ComponentLink1Description: Link; ComponentLink1URL: https://www.digikey.com/en/products/detail/yageo/RC0805FR-07470KL/727977
R11 = CMP-1012-00492-1: 681R 0.1W 1% 0603 (1608 Metric)  SMD; Value: 681.00 Ohm; Case-Metric: 1608; Case-EIA: 0603; Technology: SMT; Tolerance: 1 %; Power: 0.1 W
R12 R13 R36 R37 = CMP-1012-00058-1: 220R 0.1W 5% 0603 (1608 Metric)  SMD; Case-EIA: 0603; Case-Metric: 1608; Value: 220.00 Ohm; Technology: SMT; Power: 0.1 W; Tolerance: 5 %
R14 = CMP-1012-00050-1: 100R 0.1W 5% 0603 (1608 Metric)  SMD; Case-EIA: 0603; Value: 100.00 Ohm; Case-Metric: 1608; Tolerance: 5 %; Technology: SMT; Power: 0.1 W
R15 R16 R39 = 4K7 0603: 4K7 0.1W 1% 0603 (1608 Metric)  SMD; Case-Metric: 1608; Value: 4700.00 Ohm; Case-EIA: 0603; Power: 0.1 W; Tolerance: 1 %; Technology: SMT; ComponentLink1Description: Link; ComponentLink1URL: https://www.digikey.com/en/products/detail/yageo/RC0603FR-074K7L/727212
R20-R23 R25 = 160K 0805: RES Thick Film, 160kΩ, 1%, 0.125W, 100ppm/°C, 0805; Voltage Rating: 150V; Power Rating: 125mW; Width: 1.25mm; Case/Package: 0805; Package Quantity: 5000; Temperature Coefficient: 100ppm/°C; Length: 2mm; Height: 0.45mm; Weight: 0.000194oz; Mount: Surface Mount; Case Code (Metric): 2012; Min Operating Temperature: -55°C; Termination: SMD/SMT; Case Code (Imperial): 0805; Number of Pins: 2; Packaging: Tape and Reel; Max Operating Temperature: 155°C; Radiation Hardening: No; Military Standard: Not; Depth: 1.25mm; Tolerance: 1%; Composition: Thick Film; Contact Plating: Tin; ComponentLink1Description: Link; ComponentLink1URL: https://www.digikey.com/en/products/detail/yageo/RC0805FR-07160KL/727628
R26 R40 R45 R47 = 10K 0603: Chip Resistor, 10 KOhm, +/- 1%, 100 mW, -55 to 155 degC, 0603 (1608 Metric), RoHS, Tape and Reel; Manufacturer: Vishay Semiconductor; Voltage Rating: 75 V; Max Operating Temperature: 155 degC; PackageDescription: 2-Pin Surface Mount Device, Body 1.575 x 0.85 mm; ComponentLink1Description: Manufacturer URL; RoHSCompliant: true; PackageReference: 0603; REACH SVHC: Unknown; Length: 1.55 mm; DatasheetVersion: 06/2012; Packaging: Tape and Reel; Min Operating Temperature: -55 degC; Mounting Technology: Surface Mount; ComponentLink2URL: https://datasheet.ciiva.com/11809/0900766b80d98afc-11809037.pdf; Height: 0.45 mm; ComponentLink2Description: Datasheet; Package Quantity: 5000; ComponentLink1URL: http://www.vishay.com/; ComponentLink3Description: Link; ComponentLink3URL: https://www.digikey.com/en/products/detail/stackpole-electronics-inc/RNCP0603FTD10K0/2240139
R29 R48 R57 = 0R 0805: 0 Ohm 0805; Manufacturer: Vishay Dale; Part Number: CRCW08050000Z0EA; ComponentLink1Description: Link; ComponentLink1URL: https://www.digikey.com/en/products/detail/stackpole-electronics-inc/RMCF0805ZT0R00/1756901
R43 R44 R49 = CMP-2000-00436-2: Chip Resistors, 3.3 KOhm, +/- 1%, 0.1 W, 0603 (1608 Metric), -55 to 155 degC, RoHS, Tape and Reel / ERJ-3EKF3301V; Manufacturer: Panasonic; Max Power Dissipation: 100mW; Voltage Rating: 75V; Temperature Coefficient: 100ppm/degreesC; Datasheet Version: 42095.0; Width: 0.8mm; Mount: SurfaceMount; Radiation Hardening: No; Package URL: http://www.st.com/st-web-ui/static/active/en/resource/technical/document/datasheet/CD00001320.pdf; Depth: 0.8mm; Package Description: 2-Pin Surface Mount Device, Body 1.6 x 0.85 mm; Package Quantity: 1; Contact Plating: Tin; Length: 1.6mm; Max Operating Temperature: 155degC; RoHSCompliant: true; Datasheet URL: https://industrial.panasonic.com/cdbs/www-data/pdf/RDA0000/AOA0000C283.pdf; Height: 0.022inch; Military Standard: Not; Termination: SMD/SMT; Case Code (Metric): 1608; Composition: ThickFilm; Resistance: 3.3KOhm; Packaging: TapeandReel; Min Operating Temperature: -55degC; Case/Package: 0603; Voltage Rating (DC): 75V; Lead Free: LeadFree; Package Reference: 0603; Power Rating: 100mW; Manufacturer URL: http://www.panasonic.com/; Case Code (Imperial): 0603; REACH SVHC: NoSVHC; Number of Terminations: 2; Number of Pins: 2; Tolerance: 1%
R46 R62 R63 R65 R66 = CMP-2000-00180-1: ERJ-3EKF1001V / 1K 0603; Manufacturer: Panasonic; Part Number: ERJ-3EKF1001V
R60 R64 = CMP-2000-04091-1: 5K1 0603 / RC0603FR-075K1L; Manufacturer: Yageo; Part Number: RC0603FR-075K1L
SW1 = CMP-03400-000022-1: SWITCH SLIDE DIP SPST 100MA 24V; Washable: Yes; Contact Current Rating: 1A; Electrical Life: 1000Cycles; Number of Circuits: 4; Pitch: 0.1inch; Actuator Length: 0.99mm; Contact Resistance: 50mR; Actuator Type: Standard; Contact Post Length: 4mm; Voltage Rating (DC): 5V; Actuator Material: Polybutylene; Sealable: No (Without); Max Voltage Rating (DC): 24V; Throw Configuration: SPST; Mount: Through Hole; Type: Switch; RoHS Compliant: Yes; Min Operating Temperature: -30°C; Max Operating Temperature: 85°C; Orientation: Straight; Packaging: Rail/Tube; Series: ADE; Lead Free: Lead Free; Depth: 7.49mm; Flammability Rating: UL94 V-0; Radiation Hardening: No; Terminal Pitch: 2.54mm; Package Quantity: 35; Contact Material: Copper Alloy; Housing Color: Black; Number of Positions: 4; Length: 0.476inch; ELV: Compliant; Termination: PC Pins; Housing Material: Polyphenylene; Contact Plating: Gold; Max Current Rating: 100mA; Height: 0.138inch
SW2 = CMP-05618-000087-1: SWITCH TACTILE SPST-NO 0.02A 15V; Mechanical Life: 500000Cycles; Contact Resistance: 100mR; Max Current Rating: 20mA; Throw Configuration: SPST; Switch Function: Off-Mom; Illumination Type: Non-Illuminated; Actuator Color: Natural; Operating Force: 2.4N; Actuator Length: 0.45mm; Switch Travel: 0.25mm; Color: Clear; Size: 3.5mm; Radiation Hardening: No; Mount: Surface Mount; Package Quantity: 1; Length: 3.5mm; Height: 2.1mm; Series: EVQP2; Contact Current Rating: 20mA; Termination: J-Bend; Electrical Life: 500000Cycles; Packaging: Tape and Reel; Current Rating: 20mA; Max Operating Temperature: 85°C; Orientation: Straight; Width: 3.5mm; Max Voltage Rating (DC): 15V; RoHS Compliant: Yes; REACH SVHC: No SVHC; Min Operating Temperature: -40°C; Depth: 5.5mm; Voltage Rating (DC): 15V; Lead Free: Lead Free
TB1 = ARDUINO_NANO: Small, complete, and breadboard-friendly board based on the ATmega328 (Arduino Nano 3.x); Check_prices: https://www.snapeda.com/parts/Arduino%20Nano/Arduino/view-part/?ref=eda; Value: *; Availability: Not in stock; MP: Arduino Nano; Price: None; Package: Non-Standard Arduino; SnapEDA_Link: https://www.snapeda.com/parts/Arduino%20Nano/Arduino/view-part/?ref=snap; MF: Arduino
TP1-TP4 TP6-TP11 = Test Point Loop: Keyston Electronics 5001 Test Point Loop; Manufacturer P/N: 5001; Manufacturer: Keystone Electronics; Color: Black; Supplier 1: Digi-Key; Supplier Part Number 1: 36-5001-ND
TP16 = Test Point Pad: Test point, Pad, 30 mil
U1 = CMP-0095-00269-2: 8-bit AVR Microcontroller, 32KB Flash, 1KB EEPROM, 2KB SRAM, 32-pin TQFP, Industrial Grade (-40°C to 85°C); PackageDescription: 32-Lead, 7x7x1.0 mm Body, 0.8mm Lead Pitch, Thin Profile Plastic Quad Flat Package (TQFP); DatasheetVersion: revD, May-2011; RevisionNote: DatasheetVersion & PackageVersion updated. URLs added.; ComponentLink1URL: http://www.atmel.com/; ComponentLink2Description: ATmega48A/48PA/88A/88PA/168A/168PA/328/328P Datasheet; Code_JEDEC: MS-026-ABA; ComponentLink1Description: Manufacturer URL; PackageReference: 32A; ComponentLink3Description: ATmega48A/48PA/88A/88PA/168A/168PA/328/328P Summary; ComponentLink2URL: http://www.atmel.com/dyn/resources/prod_documents/doc8271.pdf; PackageVersion: revC, Oct-2010; ComponentLink3URL: http://www.atmel.com/dyn/resources/prod_documents/8271S.pdf
U5 = 74HC4051PW,118: IC MUX/DEMUX 8X1 16TSSOP; RoHS Compliant: Yes; ComponentLink1Description: Link; ComponentLink1URL: https://www.digikey.com/en/products/detail/nexperia-usa-inc/74HC4051PW-118/946649
U9 = CMP-2000-05029-1: IC USB FS SERIAL UART 28-SSOP; Manufacturer: FTDI; Receive FIFO: 256B; Number of Channels per Chip: 1; Maximum Data Rate: 3MBd; Transmit FIFO: 128B; Dimensions: 10.2x5.3x1.75mm; Mounting Type: SurfaceMount; Height: 1.75mm; Package Type: SSOP; Datasheet Version: Rev. 1.04, 02/2006; Width: 5.3mm; Manufacturer URL: http://www.ftdichip.com/; Datasheet URL: http://datasheet.octopart.com/FT232RL-FTDI-datasheet-120501.pdf; Maximum Operating Temperature: +85degC; Minimum Operating Temperature: -40degC; Pin Count: 28; Length: 10.2mm
U10 = CMP-1679-00001-4: Positive Voltage Regulator, 1 A, 5 V Output Voltage, 0 to 125 degC, 3-Pin D2PAK (936-03), Pb-Free, Tape and Reel; Manufacturer: ON Semiconductor; Length: 10.24 mm; RoHSCompliant: true; Package Quantity: 800; ComponentLink2URL: http://www.onsemi.com/pub_link/Collateral/MC7800-D.PDF; ComponentLink1Description: Manufacturer URL; Max Operating Temperature: 125 degC; ComponentLink3URL: http://www.onsemi.com/pub_link/Collateral/936-03.PDF; Min Operating Temperature: 0 degC; Mounting Technology: Surface Mount; Pins: 3; PackageDescription: 3-Pin Transistor Outline, Body 10.02 x 9.1945 mm, Pitch 2.54 mm; ComponentLink3Description: Package Specification; ComponentLink1URL: http://www.onsemi.com/; PackageReference: D2PAK-3-936-03; Height: 30.02 mm; REACH SVHC: No SVHC; DatasheetVersion: Rev. 27, 11/2014; Mount: Surface Mount; Packaging: Tape and Reel; ComponentLink2Description: Datasheet; PackageVersion: Rev. E, 09/2015
Y1 = CMP-27762-015167-1: Crystal 16MHz ±30ppm (Tol) ±30ppm (Stability) 10pF FUND 80Ω 4-Pin SMD T/R; ESR (Equivalent Series Resistance): 80R; Package Quantity: 1000; Frequency: 16MHz; Length: 3.2mm; Tolerance: 30ppm; Frequency Stability: 30ppm; Depth: 2.5mm; Termination: SMD/SMT; Number of Pins: 4; Max Operating Temperature: 70°C; Min Operating Temperature: -20°C; Mount: Surface Mount; Lead Free: Lead Free; Frequency Tolerance: 30ppm; Width: 2.5mm; Series: ABM8G; Load Capacitance: 10pF; Operating Frequency: 16 MHz; Case/Package: CSMD; Height: 1mm; Packaging: Tape and Reel
D9 D12 = SBRT15U50SP5-13: Supplier 1: Digi-Key; Supplier Part Number 1: SBRT15U50SP5-13DICT-ND